# Altium schematic sheet ADC.SchDoc
size A4; SheetNumber: 7; SheetTotal: 11
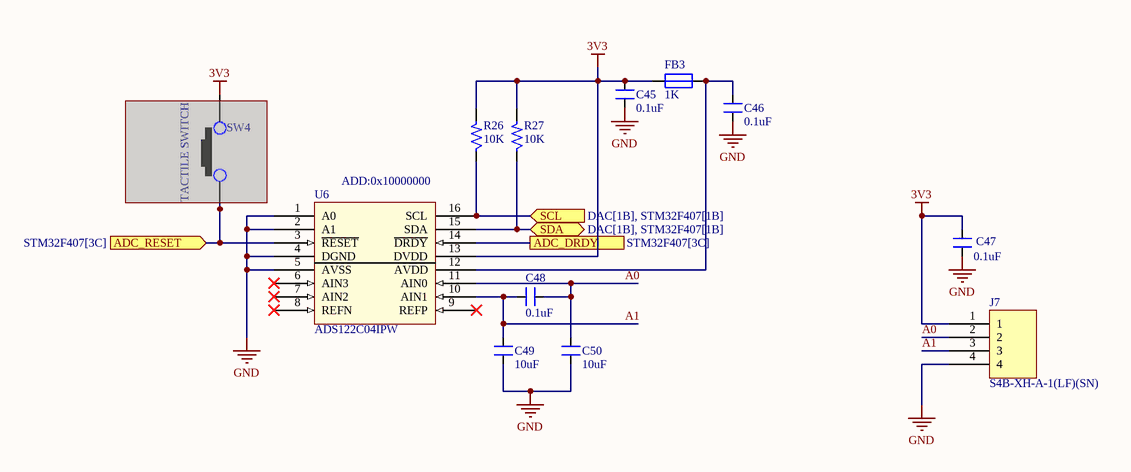
[diagram p0: ADC.SchDoc]

## Parts
C45  0.1uF  [CAP_0805]
C46  0.1uF  [CAP_0805]
C47  0.1uF  [CAP_0805]
C48  0.1uF  [CAP_0805]
C49  10uF  [CAP_1206]
C50  10uF  [CAP_1206]
FB3  1K  [IND_0805]
J7  S4B-XH-A-1(LF)(SN)  [CON4_100_S4B-XH-A_TH_RA]
R26  10K  [RES_0603]
R27  10K  [RES_0603]
SW4  TACTILE SWITCH  [SW_342_SMD]
U6  ADS122C04IPW  [TSSOP16_25-59_294_54X14_SMT]

## Ports
ADC_DRDY (see STM32F407[3C]), ADC_RESET (in, see STM32F407[3C]), SCL (in, see DAC[1B], STM32F407[1B]), SDA (bidir, see DAC[1B], STM32F407[1B])

## Nets
3V3: C45.2 C47.2 FB3.2 J7.1 R26.2 R27.2 SW4.2 U6.13(DVDD)
GND: C45.1 C46.1 C47.1 C49.1 C50.1 J7.4 U6.1(A0) U6.2(A1) U6.4(DGND) U6.5(AVSS)
A0: C48.1 C50.2 J7.2 U6.11(AIN0)
A1: C48.2 C49.2 J7.3 U6.10(AIN1)
ADC_DRDY: U6.14(~{DRDY}) ; port ADC_DRDY
ADC_RESET: SW4.1 U6.3(~{RESET}) ; port ADC_RESET
SCL: R26.1 U6.16(SCL) ; port SCL
SDA: R27.1 U6.15(SDA) ; port SDA
NetC46_2: C46.2 FB3.1 U6.12(AVDD)

Not connected (* = marked no-connect by the designer): U6 6(AIN3)* 7(AIN2)* 8(REFN)* 9(REFP)*

## Notes on the sheet
- (near U6) ADD:0x10000000

## Library data of the parts
C45-C47 = CAP_0.1uF-50V-10%-0805: 0.1µF ±10% 50V Ceramic Capacitor X7R 0805 (2012 Metric); Manufacturer: Samsung; Manufacturer Part Number: CL21B104KBCNNNC; Alternate Part Number-1: NA; Case/Package: 0805; Supplier-1: SIRICOM; Supplier Part Number-1: 0805B104K500CT
C48 = CAP_0.1uF-50V-5%-0805: 0.1µF ±5% 50V Ceramic Capacitor X7R 0805 (2012 Metric); Manufacturer: AVX Corporation; Manufacturer Part Number: 08055C104JAT4A; Alternate Part Number-1: 0805B104M500; Case/Package: 0805; Supplier-1: SIRICOM; Supplier Part Number-1: 0805B104J500CT
C49 C50 = CAP_10uF-50V-10%-1206: 10µF ±10% 50V Ceramic Capacitor X7R 1206 (3216 Metric); Manufacturer: KEMET; Manufacturer Part Number: CL31B106KBHNNNE; Alternate Part Number-1: GRT31CR61H106ME01L; Case/Package: 1206; Supplier-1: SIRICOM; Supplier Part Number-1: CC1206KKX5R9BB106
FB3 = FB_1K-100MHZ-1.6A-0805: 1 kOhms @ 100MHz 1 Power Line Ferrite Bead 0805 (2012 Metric) 1.6A; Manufacturer: Laird; Manufacturer Part Number: BLM21SP102SH1D; Alternate Part Number-1: NA; Case/Package: 0805; Supplier-1: SIRICOM; Supplier Part Number-1: ACMS201209A102
J7 = CON-PLG_4X1-100-RA-TH: 4 Pins, 1 Row 2.54mm Pitch, right angle Connector, male; Manufacturer: Wurth Electronics; Mating Part Number: XHP-4; Crimp Part Number: ASXHSXH22K51; Alternate Part Number-1: NA; Manufacturer Part Number: S4B-XH-A-1(LF)(SN); Case/Package: TH-CON; Supplier-1: LCSC; Supplier Part Number-1: S4B-XH-A
R26 R27 = RES_10K-0.1W-1%-0603: 10 kOhms ±1% 0.1W, 1/10W Chip Resistor 0603 (1608 Metric) Automotive AEC-Q200 Thick Film; Manufacturer: Walsin; Manufacturer Part Number: WR06X1002FTL; Alternate Part Number-1: 0603WAJ0103T5E; Case/Package: 0603; Supplier-1: SIRICOM; Supplier Part Number-1: WR06X1002FTL
SW4 = SW1_RS-282G05A3-SMRT-SMD: Tactile Switch SPST-NO Top Actuated Surface Mount; Manufacturer: ITT C&K; Alternate Part Number-1: NA; Manufacturer Part Number: RS-282G05A3-SMRT; Case/Package: SMD; Supplier-1: SP ROAD; Supplier Part Number-1: RS-282G05A3-SMRT
U6 = IC_ADS122C04IPW: 24 Bit Analog to Digital Converter 4 Input 1 Sigma-Delta 16-TSSOP; Manufacturer: Texas Instruments; Alternate Part Number-1: NA; Manufacturer Part Number: ADS122C04IPW; Case/Package: TSSOP16; Supplier-1: MOUSER; Supplier Part Number-1: ADS122C04IPW